# Altium schematic sheet Gate_drivers.SchDoc
size A; SheetNumber: 3; SheetTotal: 3
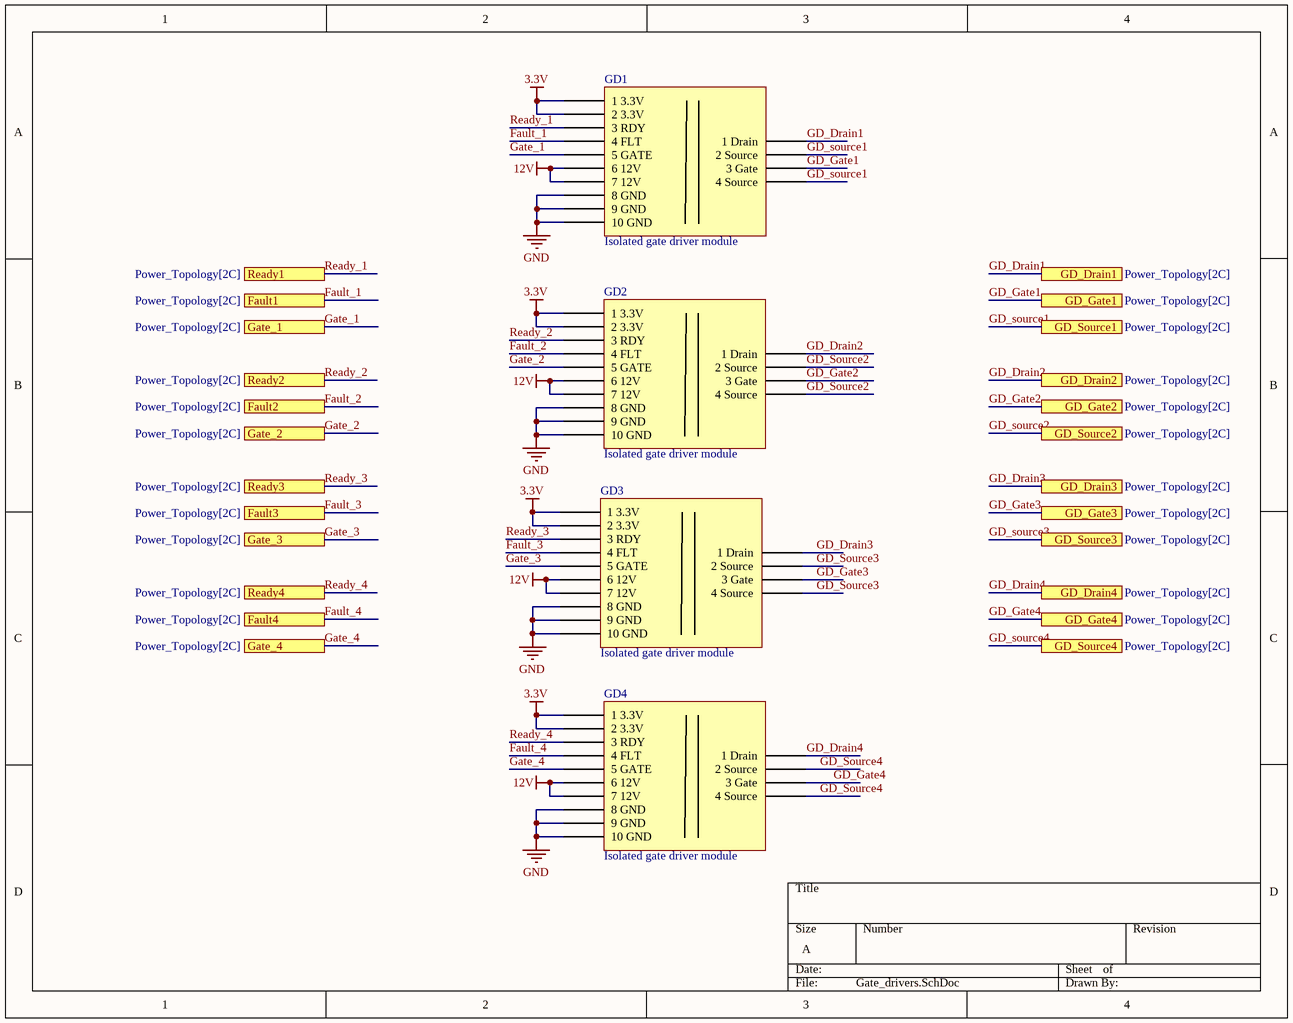
[diagram p0: Gate_drivers.SchDoc]

## Parts
GD1  Isolated gate driver module  [CON_ISOLATED_GATE_DRIVER_MODULE]
GD2  Isolated gate driver module  [CON_ISOLATED_GATE_DRIVER_MODULE]
GD3  Isolated gate driver module  [CON_ISOLATED_GATE_DRIVER_MODULE]
GD4  Isolated gate driver module  [CON_ISOLATED_GATE_DRIVER_MODULE]

## Ports
Fault1 (see Power_Topology[2C]), Fault2 (see Power_Topology[2C]), Fault3 (see Power_Topology[2C]), Fault4 (see Power_Topology[2C]), Gate_1 (see Power_Topology[2C]), Gate_2 (see Power_Topology[2C]), Gate_3 (see Power_Topology[2C]), Gate_4 (see Power_Topology[2C]), GD_Drain1 (see Power_Topology[2C]), GD_Drain2 (see Power_Topology[2C]), GD_Drain3 (see Power_Topology[2C]), GD_Drain4 (see Power_Topology[2C]), GD_Gate1 (see Power_Topology[2C]), GD_Gate2 (see Power_Topology[2C]), GD_Gate3 (see Power_Topology[2C]), GD_Gate4 (see Power_Topology[2C]), GD_Source1 (see Power_Topology[2C]), GD_Source2 (see Power_Topology[2C]), GD_Source3 (see Power_Topology[2C]), GD_Source4 (see Power_Topology[2C]), Ready1 (see Power_Topology[2C]), Ready2 (see Power_Topology[2C]), Ready3 (see Power_Topology[2C]), Ready4 (see Power_Topology[2C])

## Nets
3.3V: GD1.1(1_3.3V) GD1.2(2_3.3V) GD2.1(1_3.3V) GD2.2(2_3.3V) GD3.1(1_3.3V) GD3.2(2_3.3V) GD4.1(1_3.3V) GD4.2(2_3.3V)
12V: GD1.6(6_12V) GD1.7(7_12V) GD2.6(6_12V) GD2.7(7_12V) GD3.6(6_12V) GD3.7(7_12V) GD4.6(6_12V) GD4.7(7_12V)
GND: GD1.8(8_GND) GD1.9(9_GND) GD1.10(10_GND) GD2.8(8_GND) GD2.9(9_GND) GD2.10(10_GND) GD3.8(8_GND) GD3.9(9_GND) GD3.10(10_GND) GD4.8(8_GND) GD4.9(9_GND) GD4.10(10_GND)
Fault_1: GD1.4(4_FLT) ; port Fault1
Fault_2: GD2.4(4_FLT) ; port Fault2
Fault_3: GD3.4(4_FLT) ; port Fault3
Fault_4: GD4.4(4_FLT) ; port Fault4
Gate_1: GD1.5(5_GATE) ; port Gate_1
Gate_2: GD2.5(5_GATE) ; port Gate_2
Gate_3: GD3.5(5_GATE) ; port Gate_3
Gate_4: GD4.5(5_GATE) ; port Gate_4
GD_Drain1: GD1.11(1_Drain) ; port GD_Drain1
GD_Drain2: GD2.11(1_Drain) ; port GD_Drain2
GD_Drain3: GD3.11(1_Drain) ; port GD_Drain3
GD_Drain4: GD4.11(1_Drain) ; port GD_Drain4
GD_Gate1: GD1.13(3_Gate) ; port GD_Gate1
GD_Gate2: GD2.13(3_Gate) ; port GD_Gate2
GD_Gate3: GD3.13(3_Gate) ; port GD_Gate3
GD_Gate4: GD4.13(3_Gate) ; port GD_Gate4
GD_source1: GD1.12(2_Source) GD1.14(4_Source) ; port GD_Source1
GD_Source2: GD2.12(2_Source) GD2.14(4_Source) ; port GD_Source2
GD_Source3: GD3.12(2_Source) GD3.14(4_Source) ; port GD_Source3
GD_Source4: GD4.12(2_Source) GD4.14(4_Source) ; port GD_Source4
Ready_1: GD1.3(3_RDY) ; port Ready1
Ready_2: GD2.3(3_RDY) ; port Ready2
Ready_3: GD3.3(3_RDY) ; port Ready3
Ready_4: GD4.3(3_RDY) ; port Ready4

## Library data of the parts
GD1-GD4 = Con_Isolated_gate_driver_module: 10 + 4 Position Receptacle Connector 0.079" (2.00mm) Through Hole Gold; MPN 10pos: SMM-110-01-S-S; MPN 4pos: SMM-104-01-S-S; MF: Samtec Inc.; Created: 2021_07_07_DArancibia; Package: Through Hole, pitch 0.079" (2.00mm); Value: Isolated gate driver module; Supplier 1: Digi-Key; Supplier Part Number 1: SAM11825-ND